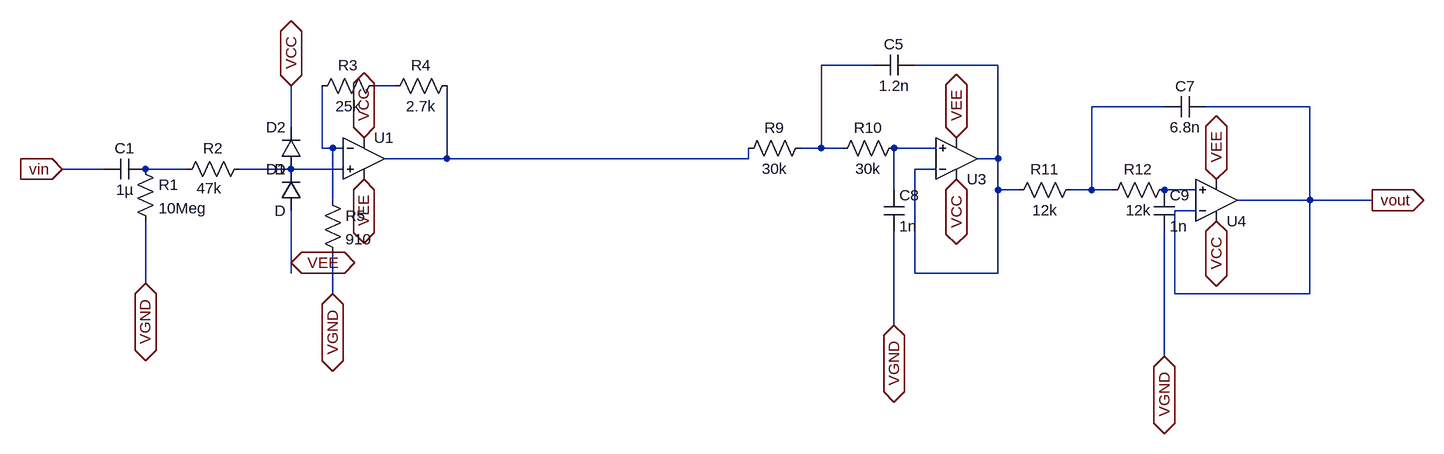
[diagram p0: schematic E24ButterworthFilter.asc]
E24ButterworthFilter.asc, the LTspice schematic file:
Version 4.1
SHEET 1 2272 680
WIRE 1392 -224 1312 -224
WIRE 1584 -224 1456 -224
WIRE 656 -192 624 -192
WIRE 1840 -160 1728 -160
WIRE 2064 -160 1904 -160
WIRE 496 -128 496 -192
WIRE 544 -96 544 -192
WIRE 560 -96 544 -96
WIRE 576 -96 560 -96
WIRE 1312 -96 1312 -224
WIRE 1312 -96 1280 -96
WIRE 1344 -96 1312 -96
WIRE 1488 -96 1424 -96
WIRE 736 -80 736 -192
WIRE 736 -80 640 -80
WIRE 1200 -80 1200 -96
WIRE 1200 -80 736 -80
WIRE 1584 -80 1584 -224
WIRE 1584 -80 1552 -80
WIRE 208 -64 144 -64
WIRE 336 -64 272 -64
WIRE 496 -64 416 -64
WIRE 576 -64 496 -64
WIRE 1488 -64 1456 -64
WIRE 1424 -32 1424 -96
WIRE 1584 -32 1584 -80
WIRE 1616 -32 1584 -32
WIRE 1728 -32 1728 -160
WIRE 1728 -32 1696 -32
WIRE 1760 -32 1728 -32
WIRE 1888 -32 1840 -32
WIRE 560 -16 560 -96
WIRE 2064 -16 2064 -160
WIRE 2064 -16 1952 -16
WIRE 2160 -16 2064 -16
WIRE 1888 0 1856 0
WIRE 496 80 496 0
WIRE 496 96 496 80
WIRE 1456 96 1456 -64
WIRE 1584 96 1584 -32
WIRE 1584 96 1456 96
WIRE 272 112 272 16
WIRE 560 128 560 64
WIRE 1856 128 1856 0
WIRE 2064 128 2064 -16
WIRE 2064 128 1856 128
WIRE 1424 176 1424 32
WIRE 1840 224 1840 32
FLAG 608 -112 VCC
IOPIN 608 -112 BiDir
FLAG 608 -48 VEE
IOPIN 608 -48 BiDir
FLAG 496 -192 VCC
IOPIN 496 -192 BiDir
FLAG 496 80 VEE
IOPIN 496 80 BiDir
FLAG 1520 -48 VCC
IOPIN 1520 -48 BiDir
FLAG 1920 16 VCC
IOPIN 1920 16 BiDir
FLAG 1520 -112 VEE
IOPIN 1520 -112 BiDir
FLAG 1920 -48 VEE
IOPIN 1920 -48 BiDir
FLAG 272 112 VGND
IOPIN 272 112 BiDir
FLAG 560 128 VGND
IOPIN 560 128 BiDir
FLAG 1424 176 VGND
IOPIN 1424 176 BiDir
FLAG 1840 224 VGND
IOPIN 1840 224 BiDir
FLAG 144 -64 vin
IOPIN 144 -64 In
FLAG 2160 -16 vout
IOPIN 2160 -16 Out
SYMBOL OpAmps\\UniversalOpAmp2 608 -80 R0
SYMATTR InstName U1
SYMBOL cap 272 -80 R90
WINDOW 0 0 32 VBottom 2
WINDOW 3 32 32 VTop 2
SYMATTR InstName C1
SYMATTR Value 1µ
SYMBOL res 256 -80 R0
SYMATTR InstName R1
SYMATTR Value 10Meg
SYMBOL res 432 -80 R90
WINDOW 0 0 56 VBottom 2
WINDOW 3 30 62 VTop 2
SYMATTR InstName R2
SYMATTR Value 47k
SYMBOL diode 512 0 R180
WINDOW 0 24 64 Left 2
WINDOW 3 24 0 Left 2
SYMATTR InstName D1
SYMBOL diode 512 -64 R180
WINDOW 0 24 64 Left 2
WINDOW 3 24 0 Left 2
SYMATTR InstName D2
SYMBOL res 640 -208 R90
WINDOW 0 0 56 VBottom 2
WINDOW 3 32 56 VTop 2
SYMATTR InstName R3
SYMATTR Value 25k
SYMBOL res 752 -208 R90
WINDOW 0 0 56 VBottom 2
WINDOW 3 32 56 VTop 2
SYMATTR InstName R4
SYMATTR Value 2.7k
SYMBOL res 544 -32 R0
SYMATTR InstName R5
SYMATTR Value 910
SYMBOL res 1296 -112 R90
WINDOW 0 0 56 VBottom 2
WINDOW 3 32 56 VTop 2
SYMATTR InstName R9
SYMATTR Value 30k
SYMBOL res 1440 -112 R90
WINDOW 0 0 56 VBottom 2
WINDOW 3 32 56 VTop 2
SYMATTR InstName R10
SYMATTR Value 30k
SYMBOL res 1712 -48 R90
WINDOW 0 0 56 VBottom 2
WINDOW 3 32 56 VTop 2
SYMATTR InstName R11
SYMATTR Value 12k
SYMBOL res 1856 -48 R90
WINDOW 0 0 56 VBottom 2
WINDOW 3 32 56 VTop 2
SYMATTR InstName R12
SYMATTR Value 12k
SYMBOL cap 1456 -240 R90
WINDOW 0 0 32 VBottom 2
WINDOW 3 32 32 VTop 2
SYMATTR InstName C5
SYMATTR Value 1.2n
SYMBOL cap 1904 -176 R90
WINDOW 0 0 32 VBottom 2
WINDOW 3 32 32 VTop 2
SYMATTR InstName C7
SYMATTR Value 6.8n
SYMBOL OpAmps\\UniversalOpAmp2 1520 -80 M180
SYMATTR InstName U3
SYMATTR Value2 Avol=1Meg GBW=3Meg Slew=10Meg
SYMBOL OpAmps\\UniversalOpAmp2 1920 -16 M180
SYMATTR InstName U4
SYMATTR Value2 Avol=1Meg GBW=3Meg Slew=10Meg
SYMBOL cap 1408 -32 R0
SYMATTR InstName C8
SYMATTR Value 1n
SYMBOL cap 1824 -32 R0
SYMATTR InstName C9
SYMATTR Value 1n

The netlist it stands for:
* E24ButterworthFilter.asc
X§U1 N009 N005 VCC VEE N007 level2 Avol=1Meg GBW=10Meg Slew=10Meg Ilimit=25m Rail=0 Vos=0 En=0 Enk=0 In=0 Ink=0 Rin=500Meg  ; pins In+ In- V+ V- OUT
C1 N008 vin 1µ
R1 N008 VGND 10Meg
R2 N009 N008 47k
D1 VEE N009 D
D2 N009 VCC D
R3 N003 N005 25k
R4 N007 N003 2.7k
R5 N005 VGND 910
R9 N001 N007 30k
R10 N006 N001 30k
R11 N004 N002 12k
R12 N010 N004 12k
C5 N002 N001 1.2n
C7 vout N004 6.8n
X§U3 N006 N002 VCC VEE N002 level2 Avol=1Meg GBW=3Meg Slew=10Meg Ilimit=25m Rail=0 Vos=0 En=0 Enk=0 In=0 Ink=0 Rin=500Meg  ; pins In+ In- V+ V- OUT
X§U4 N010 vout VCC VEE vout level2 Avol=1Meg GBW=3Meg Slew=10Meg Ilimit=25m Rail=0 Vos=0 En=0 Enk=0 In=0 Ink=0 Rin=500Meg  ; pins In+ In- V+ V- OUT
C8 N006 VGND 1n
C9 N010 VGND 1n
.model D D
.lib standard.dio
.lib UniversalOpAmp2.lib
.backanno
.end